# Altium schematic sheet SCA-Power.SchDoc: SCA Power
size A; DocumentNumber: 18; SheetNumber: 18; SheetTotal: 22
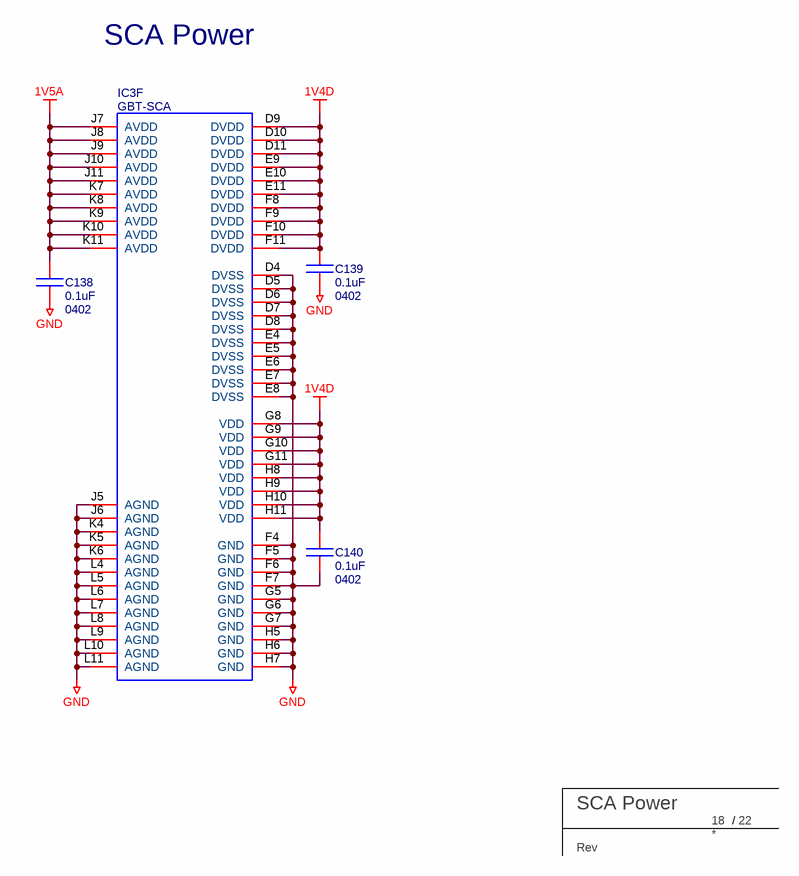
[diagram p0: SCA-Power.SchDoc]

## Parts
C138  0.1uF  Package: 0402  [C_0402_IPC_NOSILK]
C139  0.1uF  Package: 0402  [C_0402_IPC_NOSILK]
C140  0.1uF  Package: 0402  [C_0402_IPC_NOSILK]
IC3  GBT-SCA  [BGA196C80P14X14_1200X1200X170]  (part F of 6)
TBLOCK?  BU Title block  (value not drawn)  (graphical)

## Nets
1V4D: C139.1 C140.1 IC3.D9(DVDD) IC3.D10(DVDD) IC3.D11(DVDD) IC3.E9(DVDD) IC3.E10(DVDD) IC3.E11(DVDD) IC3.F8(DVDD) IC3.F9(DVDD) IC3.F10(DVDD) IC3.F11(DVDD) IC3.G8(VDD) IC3.G9(VDD) IC3.G10(VDD) IC3.G11(VDD) IC3.H8(VDD) IC3.H9(VDD) IC3.H10(VDD) IC3.H11(VDD)
1V5A: C138.1 IC3.J7(AVDD) IC3.J8(AVDD) IC3.J9(AVDD) IC3.J10(AVDD) IC3.J11(AVDD) IC3.K7(AVDD) IC3.K8(AVDD) IC3.K9(AVDD) IC3.K10(AVDD) IC3.K11(AVDD)
GND: C138.2 C139.2 C140.2 IC3.D4(DVSS) IC3.D5(DVSS) IC3.D6(DVSS) IC3.D7(DVSS) IC3.D8(DVSS) IC3.E4(DVSS) IC3.E5(DVSS) IC3.E6(DVSS) IC3.E7(DVSS) IC3.E8(DVSS) IC3.F4(GND) IC3.F5(GND) IC3.F6(GND) IC3.F7(GND) IC3.G5(GND) IC3.G6(GND) IC3.G7(GND) IC3.H5(GND) IC3.H6(GND) IC3.H7(GND) IC3.J5(AGND) IC3.J6(AGND) IC3.K4(AGND) IC3.K5(AGND) IC3.K6(AGND) IC3.L4(AGND) IC3.L5(AGND) IC3.L6(AGND) IC3.L7(AGND) IC3.L8(AGND) IC3.L9(AGND) IC3.L10(AGND) IC3.L11(AGND)

## Notes on the sheet
- SCA Power
- (in symbol TITLE_BLOCK_BU) /; Rev

## Library data of the parts
C138-C140 = C-CER-E5-0.1uF-0402-25V-X7R: GRM155R71E104ME14D; Voltage: 25V; TempCo: X7R
IC3 = CERN_GBT-SCA_REV 6.2: The Slow Control Adapter ASIC for the GBT System; Device: GBT-SCA
TBLOCK? = TITLE_BLOCK_BU